# EasyEDA Pro project Example_3D Shell Design.eprj, board 3D Shell Example-B
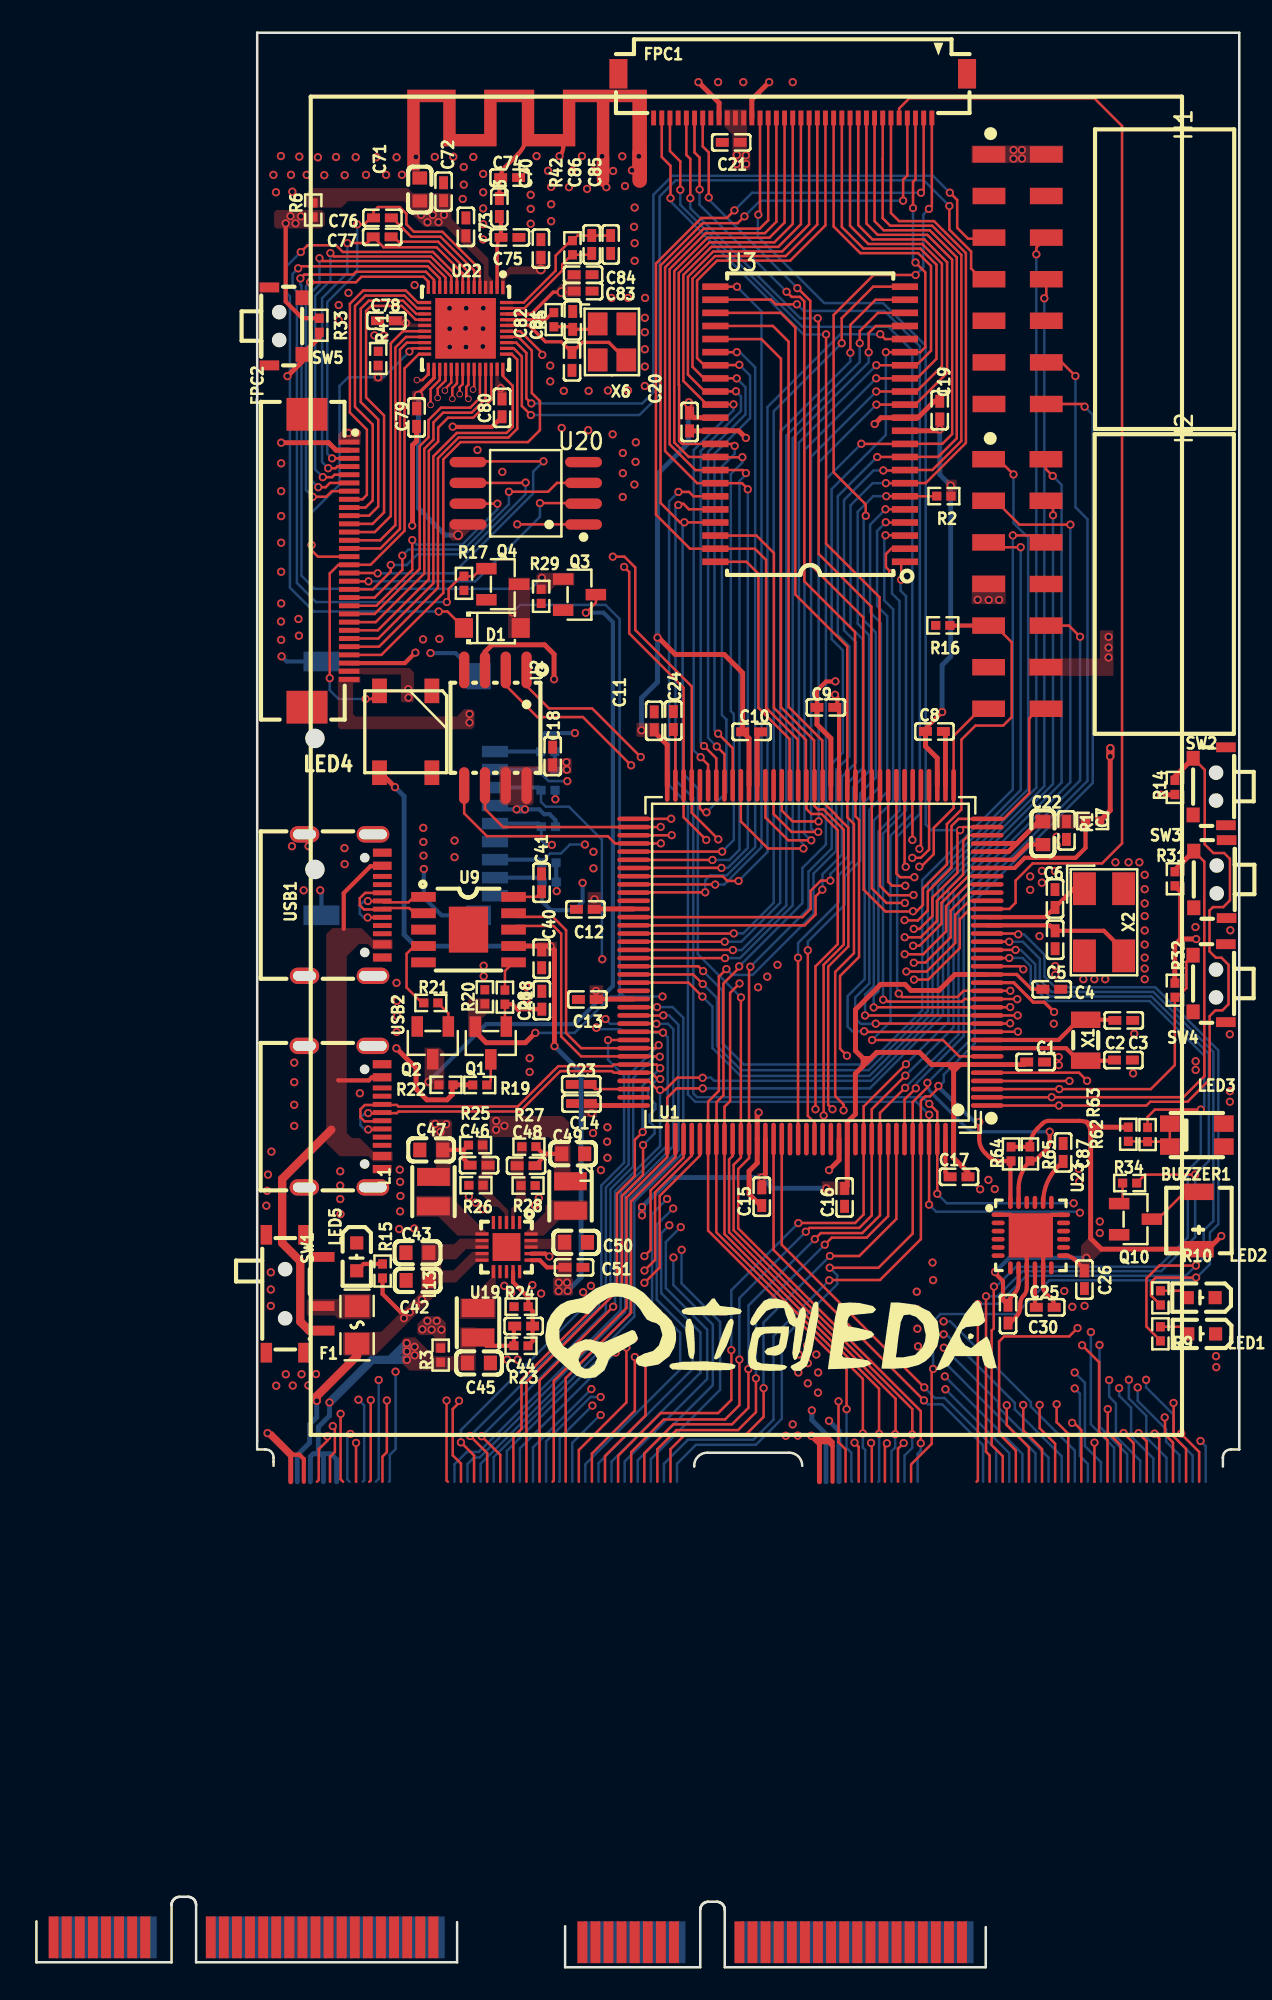
[diagram p0: board, top side]
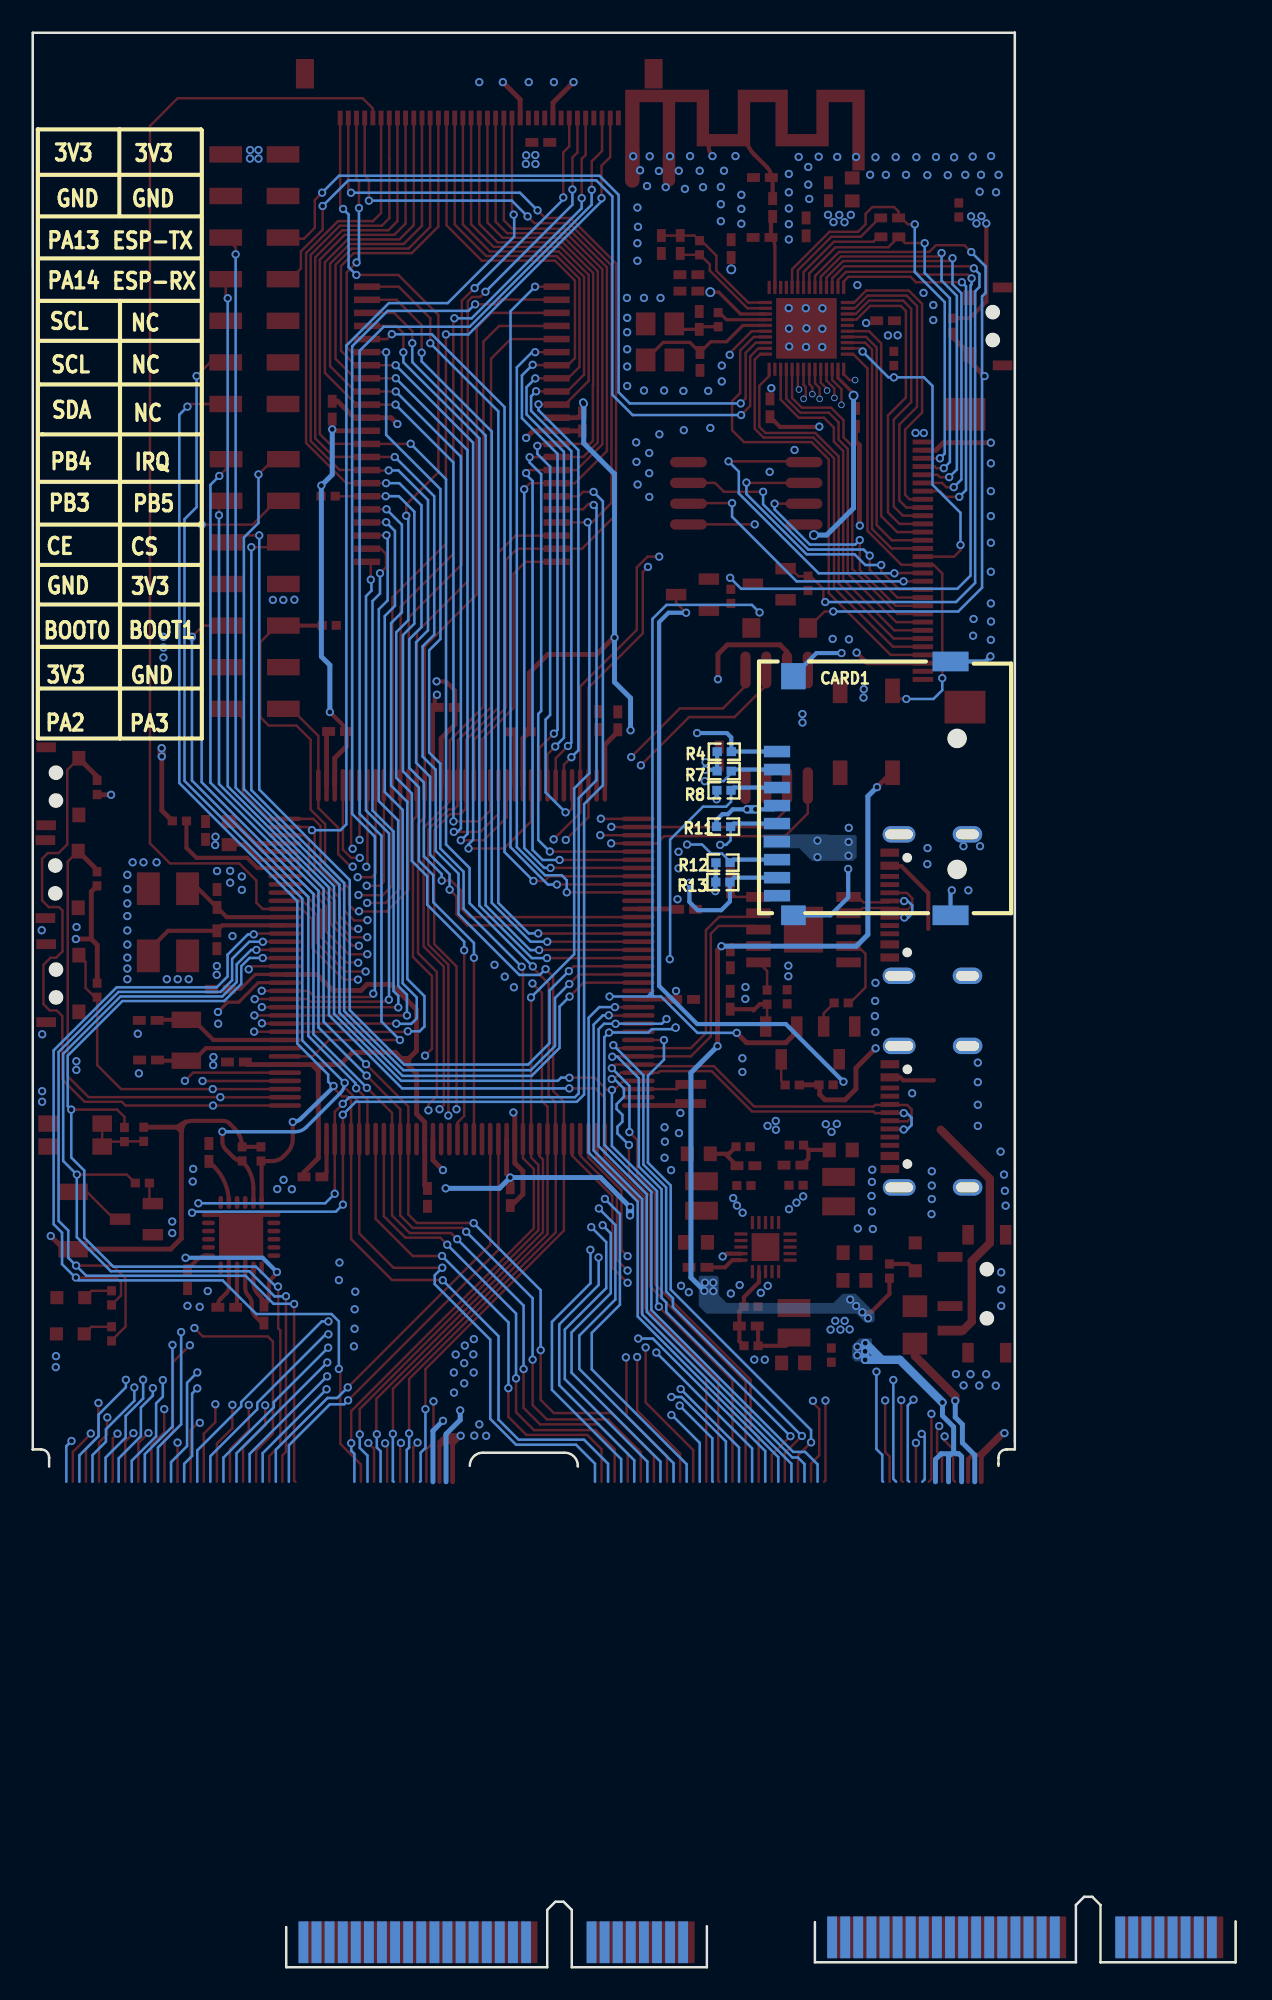
[diagram p1: board, bottom side, seen from below]

Outline 73.49 x 118.12 mm; copper layers: Top Layer, Inner1, Inner2, Bottom Layer. Coordinates in mm from the lower left corner of the outline.
Outline path: 14.49,30.62 14.49,31.12 arc(14.34,31.48) 13.99,31.62 13.99,31.62 13.49,31.62 13.49,118.12 73.49,118.12 73.48,31.62 73.48,31.62 72.99,31.62 arc(72.63,31.48) 72.49,31.12 72.49,30.57 ; 40.19,30.57 40.19,30.62 arc(40.42,31.19) 40.99,31.42 45.98,31.42 arc(46.55,31.19) 46.79,30.62
Stack: Top Layer 0.035mm / 介电1 0.48mm PP er 4.5 / Inner1 0.035mm / 介电2 0.48mm FR4 er 4.5 / Inner2 0.035mm / 介电3 0.48mm PP er 4.5 / Bottom Layer 0.035mm

## Design rules (mm)
spacing Common: track to track 0.152, other pairs 0.152 to 0.3
spacing 安全间距 (default): track to track 0.127, other pairs 0.127 to 0.3
track width Common: min 0.127, default 0.254, max 2.54
track width 导线 (default): min 0.127, default 0.254, max 5
differential pair Common (default): width min 0.127, default 0.254, max 2.54; gap min 0.152, default 0.152
via Common: diameter min 0.5, default 0.61, max 10; hole min 0.3, default 0.305, max 6
via 过孔尺寸 (default): diameter min 0.4, default 0.5, max 10; hole min 0.3, default 0.3, max 6

## Placement (name value [footprint] x y rotation side)
BUZZER1  4000Hz  [buz-smd_l4.0-w4.0-p3.50-l]  71.02 45.59 90 top
C1  100nF  [c0402]  61.04 55.27 180 top
C2  10pF  [c0402]  66.43 57.81 0 top
C3  10pF  [c0402]  66.41 55.39 0 top
C4  100nF  [c0402]  62.03 59.71 180 top
C5  22pF  [c0402]  62.24 62.74 90 top
C6  22pF  [c0402]  62.23 65.26 270 top
C7  100nF  [c0402]  62.93 69.41 270 top
C8  100nF  [c0402]  54.86 75.45 180 top
C9  100nF  [c0402]  48.23 76.92 180 top
C10  100nF  [c0402]  43.69 75.43 180 top
C11  100nF  [c0402]  37.74 76.11 270 top
C12  100nF  [c0402]  33.54 64.6 180 top
C13  100nF  [c0402]  33.66 59.09 180 top
C14  100nF  [c0402]  33.3 52.74 180 top
C15  100nF  [c0402]  44.31 47.05 270 top
C16  100nF  [c0402]  49.37 47.01 270 top
C17  100nF  [c0402]  56.37 48.26 180 top
C18  100nF  [c0402]  31.54 73.95 90 top
C19  100nF  [c0402]  55.19 95.07 270 top
C20  100nF  [c0402]  39.91 94.35 270 top
C21  100nF  [c0402]  42.45 111.42 0 top
C22  10uF  [c0603]  61.49 69.25 90 top
C23  2.2uF  [c0402]  33.28 53.91 180 top
C24  2.2uF  [c0402]  38.91 76.12 270 top
C25  100nF  [c0402]  61.63 40.3 0 top
C26  100nF  [c0402]  64.03 41.98 90 top
C28  100nf  [c0402]  30.88 59.04 270 top
C30  10nF  [c0402]  59.36 39.88 270 top
C40  1uF  [c0402]  30.87 61.58 90 top
C41  100nF  [c0402]  30.86 66.22 270 top
C42  10uF  [c0603]  23.29 41.94 180 top
C43  10uF  [c0603]  23.28 43.63 180 top
C44  220pF  [c0402]  29.77 39.15 0 top
C45  10uF  [c0603]  27.03 36.9 180 top
C46  220pF  [c0402]  27.04 48.97 0 top
C47  10uF  [c0603]  24.12 49.9 0 top
C48  220pF  [c0402]  29.91 48.94 0 top
C49  10uF  [c0603]  32.79 49.67 0 top
C50  10uF  [c0603]  32.97 44.26 180 top
C51  1uF  [c0402]  32.84 42.74 180 top
C70  100nF  [c0402]  30.82 104.94 270 top
C71  10uF  [c0603]  23.42 108.55 90 top
C72  1uF  [c0402]  24.87 108.41 270 top
C73  100nF  [c0402]  26.24 106.27 270 top
C74  TBD  [c0402]  28.91 109.27 0 top
C75  TBD  [c0402]  28.93 105.62 0 top
C76  270pF(NC)  [c0402]  21.14 106.81 180 top
C77  270pF(NC)  [c0402]  21.12 105.65 0 top
C78  100nF  [c0402]  21.38 100.53 0 top
C79  4.7uF  [c0402]  23.23 94.63 90 top
C80  100nF  [c0402]  28.45 95.22 90 top
C81  22pF  [c0402]  32.72 98.05 90 top
C82  22pF  [c0402]  32.77 100.55 270 top
C83  1uF  [c0402]  33.4 102.34 180 top
C84  100pF  [c0402]  33.4 103.34 180 top
C85  3.3nF  [c0402]  33.93 105.19 90 top
C86  10nF  [c0402]  35.08 105.19 270 top
C87  2.2nF  [c0402]  62.72 49.75 90 top
CARD1  -  [tf-smd_xktf-n02-n]  22.71 71.98 90 bottom
D1  -  [sod-123_l2.7-w1.6-ls3.8-rd]  27.85 81.77 0 top
F1  -  [f0805]  19.59 39.22 270 top
FPC1  -  [fpc-smd_f0502-b-35-15t-r]  46.21 114.26 180 top
FPC2  -  [fpc-smd_30p-p0.50_xunpu_fpc-05f-30ph20]  17.82 85.88 270 top
H1  -  [hdr-smd_14p-p2.54-h-f-r2-c7-s3.50]  59.94 103.07 270 top
H2  -  [hdr-smd_14p-p2.54-h-f-r2-c7-s3.50]  59.92 84.46 270 top
L1  1.5uH  [ind-smd_l2.5-w2.0_252012]  24.26 47.36 270 top
L2  1.5uH  [ind-smd_l2.5-w2.0_252012]  32.63 47.09 270 top
L3  TBD  [l0402]  28.28 107.45 270 top
L13  1.5uH  [ind-smd_l2.5-w2.0_252012]  26.98 39.35 270 top
LED1  -  [led0603-r-rd]  71.19 38.67 180 top
LED2  -  [led0603-r-rd]  71.16 40.88 180 top
LED3  -  [led-smd_4p-l3.2-w2.7-r-rd]  70.89 50.81 0 top
LED4  WS2812B  [ws2812b]  22.56 75.43 90 top
LED5  -  [led0603-r-rd]  19.57 43.38 270 top
Q1  -  [sot-23-3_l2.9-w1.3-p1.90-ls2.4-br]  27.76 56.43 90 top
Q2  -  [sot-23-3_l2.9-w1.3-p1.90-ls2.4-br]  24.22 56.44 90 top
Q3  -  [sot-23-3_l2.9-w1.3-p1.90-ls2.4-br]  33.18 83.81 180 top
Q4  -  [sot-23-3_l2.9-w1.3-p1.90-ls2.4-br]  28.49 84.45 180 top
Q10  -  [sot-23-3_l2.9-w1.3-p1.90-ls2.4-br]  67.15 45.68 180 top
R1  10Ω  [r0402]  64.53 69.99 180 top
R2  10kΩ  [r0402]  55.44 89.82 180 top
R3  0Ω  [r0402]  24.7 37.37 90 top
R4  10kΩ  [r0402]  31.24 74.22 180 bottom
R5  0Ω  [r0402]  31.61 100.6 270 top
R6  0Ω  [r0402]  16.91 107.3 90 top
R7  10kΩ  [r0402]  31.24 73.04 180 bottom
R8  10kΩ  [r0402]  31.26 71.86 180 bottom
R9  4.7kΩ  [r0402]  68.67 38.67 90 top
R10  4.7kΩ  [r0402]  68.67 40.87 90 top
R11  10kΩ  [r0402]  31.28 69.64 180 bottom
R12  10kΩ  [r0402]  31.31 67.44 180 bottom
R13  10kΩ  [r0402]  31.32 66.26 180 bottom
R14  10kΩ  [r0402]  69.55 72.04 270 top
R15  4.7kΩ  [r0402]  21.15 42.51 90 top
R16  10kΩ  [r0402]  55.37 81.93 0 top
R17  10kΩ  [r0402]  26.12 84.5 90 top
R18  10kΩ  [r0402]  28.62 59.23 270 top
R19  1kΩ  [r0402]  27.09 53.87 180 top
R20  10kΩ  [r0402]  27.4 59.25 270 top
R21  10kΩ  [r0402]  24.1 58.88 180 top
R22  10kΩ  [r0402]  25.02 53.88 0 top
R23  68kΩ  [r0402]  29.6 37.94 0 top
R24  15kΩ  [r0402]  29.61 40.34 180 top
R25  110K  [r0402]  26.83 50.2 0 top
R26  30kΩ  [r0402]  26.85 47.75 0 top
R27  100kΩ  [r0402]  30.09 50.1 0 top
R28  100kΩ  [r0402]  30.04 47.73 0 top
R29  10kΩ  [r0402]  30.84 83.7 90 top
R31  10kΩ  [r0402]  69.56 66.46 270 top
R32  10kΩ  [r0402]  69.55 59.66 90 top
R33  10kΩ  [r0402]  17.28 100.26 90 top
R34  1kΩ  [r0402]  66.79 47.88 180 top
R41  0Ω(NC)  [r0402]  20.88 98.23 270 top
R42  20kΩ  [r0402]  32.75 104.99 90 top
R62  47kΩ  [r0402]  66.71 50.86 90 top
R63  1kΩ  [r0402]  67.88 50.84 270 top
R64  4.7kΩ  [r0402]  59.54 49.66 90 top
R65  4.7kΩ  [r0402]  60.7 49.66 90 top
SW1  -  [sw-th_msk12c02]  15.75 41.12 270 top
SW2  -  [key-smd_k2-1806sa-axxw-xx]  71.67 72.11 270 top
SW3  -  [key-smd_k2-1806sa-axxw-xx]  71.71 66.44 270 top
SW4  -  [key-smd_k2-1806sa-axxw-xx]  71.67 60.09 270 top
SW5  -  [key-smd_k2-1806sa-axxw-xx]  15.23 100.19 90 top
U1  -  [lqfp-144_l20.0-w20.0-p0.50-ls22.0-bl]  47.29 61.37 90 top
U2  -  [soic-8_l5.2-w5.2-p1.27-ls7.9-bl]  28.04 75.68 180 top
U3  IS62WV51216  [tsopii-44_l18.4-w10.2-p0.80-ls11.8-bl]  47.27 94.21 90 top
U4  -  [mini-pcie 0.8-52p]  46.79 28.22 0 top
U5  -  [mini-pcie 0.8-52p]  14.49 28.52 0 top
U9  -  [esop-10_l4.9-w3.9-p1.00-ls6.2-bl-ep]  26.4 63.36 270 top
U19  -  [wqfn-20_l3.0-w3.0-p0.40-bl-ep]  28.72 43.97 180 top
U20  -  [soic-8_l5.3-w5.3-p1.27-ls8.0-bl]  29.9 90 90 top
U22  -  [qfn-48_l5.0-w5.0-p0.35-bl-ep3.7]  26.22 100.07 180 top
U23  -  [qfn-24_l4.0-w4.0-p0.50-bl-ep2.7]  60.75 44.7 270 top
U24  -  [tan]  29.99 111.72 0 top
USB1  -  [usb-c-smd_type-c-31-m-31]  18.76 64.85 270 top
USB2  -  [usb-c-smd_type-c-31-m-31]  18.75 51.94 270 top
X1  32.768kHz  [fc-135r_l3.2-w1.5]  64.1 56.6 90 top
X2  8MHz  [osc-smd_4p-l5.0-w3.2-bl]  65.22 63.8 270 top
X6  40MHZ±10ppm  [osc-smd_4p-l3.2-w2.5-bl]  35.16 99.24 270 top

## Footprints (pads in the part's own frame, mm; a bottom-side part is the same pattern mirrored in y, then rotated)
buz-smd_l4.0-w4.0-p3.50-l
  rect 1.001x1.801 smd: 1(-1.75,0) 2(1.75,0)
c0402
  rect 0.79x0.541 smd: 1(-0.546,0) 2(0.546,0)
c0603
  rect 0.8x0.899 smd: 1(-0.701,0) 2(0.701,0)
esop-10_l4.9-w3.9-p1.00-ls6.2-bl-ep
  rect 0.6x1.501 smd: 1(-1.999,-2.751) 2(-1.001,-2.751) 3(0,-2.751) 4(1.001,-2.751) 5(1.999,-2.751) 6(1.999,2.751) 7(1.001,2.751) 8(0,2.751) 9(-1.001,2.751) 10(-1.999,2.751)
  rect 2.799x2.401 smd: 11(0,0)
f0805
  rect 1.336x1.501 smd: 1(-1.143,0) 2(1.143,0)
fc-135r_l3.2-w1.5
  rect 1.001x1.801 smd: 1(-1.25,0) 2(1.25,0)
fpc-smd_30p-p0.50_xunpu_fpc-05f-30ph20
  rect 0.299x1.25 smd: 1(-7.249,1.288) 2(-6.749,1.288) 3(-6.251,1.288) 4(-5.75,1.288) 5(-5.25,1.288) 6(-4.75,1.288) 7(-4.25,1.288) 8(-3.749,1.288) 9(-3.248,1.288) 10(-2.751,1.288) 11(-2.251,1.288) 12(-1.75,1.288) 13(-1.25,1.288) 14(-0.75,1.288) 15(-0.249,1.288) 16(0.249,1.288) 17(0.75,1.288) 18(1.25,1.288) 19(1.75,1.288) 20(2.251,1.288) 21(2.751,1.288) 22(3.251,1.288) 23(3.749,1.288) 24(4.25,1.288) 25(4.75,1.288) 26(5.25,1.288) 27(5.75,1.288) 28(6.251,1.288) 29(6.752,1.288) 30(7.249,1.288)
  rect 1.999x2.499 smd: 31(8.941,-1.288) 32(-8.941,-1.288)
fpc-smd_f0502-b-35-15t-r
  rect 0.299x0.899 smd: 1(-8.499,1.351) 2(-8.001,1.351) 3(-7.5,1.351) 4(-7,1.351) 5(-6.5,1.351) 6(-6,1.351) 7(-5.499,1.351) 8(-4.998,1.351) 9(-4.501,1.351) 10(-4,1.351) 11(-3.5,1.351) 12(-2.999,1.351) 13(-2.499,1.351) 14(-1.999,1.351) 15(-1.501,1.351) 16(-1.001,1.351) 17(-0.5,1.351) 18(0,1.351) 19(0.5,1.351) 20(1.001,1.351) 21(1.501,1.351) 22(1.999,1.351) 23(2.499,1.351) 24(2.999,1.351) 25(3.5,1.351) 26(4,1.351) 27(4.501,1.351) 28(5.002,1.351) 29(5.499,1.351) 30(6,1.351) 31(6.5,1.351) 32(7,1.351) 33(7.5,1.351) 34(8.001,1.351) 35(8.499,1.351)
  rect 1.1x1.801 smd: 36(10.65,-1.349) 37(-10.65,-1.349)
hdr-smd_14p-p2.54-h-f-r2-c7-s3.50
  rect 1.001x1.999 smd: 1(-7.62,-1.75) 2(-7.62,1.75) 3(-5.08,-1.75) 4(-5.08,1.75) 5(-2.54,-1.75) 6(-2.54,1.75) 7(0,-1.75) 8(0,1.75) 9(2.54,-1.75) 10(2.54,1.75) 11(5.08,-1.75) 12(5.08,1.75) 13(7.62,-1.75) 14(7.62,1.75)
ind-smd_l2.5-w2.0_252012
  rect 1.1x1.999 smd: 1(-0.899,0) 2(0.899,0)
key-smd_k2-1806sa-axxw-xx
  rect 0.899x0.8 smd: 1(-1.71,-1.001) 2(1.75,-1.001)
  rect 0.6x1.199 smd: 3(-2.38,1.001) 4(2.38,1.001)
l0402
  rect 0.79x0.541 smd: 1(-0.546,0) 2(0.546,0)
led0603-r-rd
  rect 0.8x0.8 smd: 1(0.851,0) 2(-0.851,0)
led-smd_4p-l3.2-w2.7-r-rd
  rect 1.199x1.001 smd: 1(1.651,0.701) 1(1.651,-0.701) 2(-1.651,0.701) 2(-1.651,-0.701)
lqfp-144_l20.0-w20.0-p0.50-ls22.0-bl
  oval 0.28x1.999 smd: 1(-8.751,-10.8) 2(-8.25,-10.8) 3(-7.75,-10.8) 4(-7.249,-10.8) 5(-6.749,-10.8) 6(-6.251,-10.8) 7(-5.75,-10.8) 8(-5.25,-10.8) 9(-4.75,-10.8) 10(-4.25,-10.8) 11(-3.749,-10.8) 12(-3.251,-10.8) 13(-2.751,-10.8) 14(-2.251,-10.8) 15(-1.75,-10.8) 16(-1.25,-10.8) 17(-0.75,-10.8) 18(-0.249,-10.8) 19(0.249,-10.8) 20(0.75,-10.8) 21(1.25,-10.8) 22(1.75,-10.8) 23(2.251,-10.8) 24(2.751,-10.8) 25(3.251,-10.8) 26(3.749,-10.8) 27(4.25,-10.8) 28(4.75,-10.8) 29(5.25,-10.8) 30(5.75,-10.8) 31(6.251,-10.8) 32(6.752,-10.8) 33(7.249,-10.8) 34(7.75,-10.8) 35(8.25,-10.8) 36(8.751,-10.8) 73(8.751,10.8) 74(8.25,10.8) 75(7.75,10.8) 76(7.249,10.8) 77(6.752,10.8) 78(6.251,10.8) 79(5.75,10.8) 80(5.25,10.8) 81(4.75,10.8) 82(4.25,10.8) 83(3.749,10.8) 84(3.251,10.8) 85(2.751,10.8) 86(2.251,10.8) 87(1.75,10.8) 88(1.25,10.8) 89(0.75,10.8) 90(0.249,10.8) 91(-0.249,10.8) 92(-0.75,10.8) 93(-1.25,10.8) 94(-1.75,10.8) 95(-2.251,10.8) 96(-2.751,10.8) 97(-3.251,10.8) 98(-3.749,10.8) 99(-4.25,10.8) 100(-4.75,10.8) 101(-5.25,10.8) 102(-5.75,10.8) 103(-6.251,10.8) 104(-6.749,10.8) 105(-7.249,10.8) 106(-7.75,10.8) 107(-8.25,10.8) 108(-8.751,10.8)
  oval 1.999x0.28 smd: 37(10.8,-8.751) 38(10.8,-8.25) 39(10.8,-7.75) 40(10.8,-7.249) 41(10.8,-6.749) 42(10.8,-6.251) 43(10.8,-5.75) 44(10.8,-5.25) 45(10.8,-4.75) 46(10.8,-4.25) 47(10.8,-3.749) 48(10.8,-3.251) 49(10.8,-2.751) 50(10.8,-2.251) 51(10.8,-1.75) 52(10.8,-1.25) 53(10.8,-0.75) 54(10.8,-0.249) 55(10.8,0.249) 56(10.8,0.75) 57(10.8,1.25) 58(10.8,1.75) 59(10.8,2.251) 60(10.8,2.751) 61(10.8,3.251) 62(10.8,3.749) 63(10.8,4.25) 64(10.8,4.75) 65(10.8,5.25) 66(10.8,5.75) 67(10.8,6.251) 68(10.8,6.749) 69(10.8,7.249) 70(10.8,7.75) 71(10.8,8.25) 72(10.8,8.751) 109(-10.8,8.751) 110(-10.8,8.25) 111(-10.8,7.75) 112(-10.8,7.249) 113(-10.8,6.749) 114(-10.8,6.251) 115(-10.8,5.75) 116(-10.8,5.25) 117(-10.8,4.75) 118(-10.8,4.25) 119(-10.8,3.749) 120(-10.8,3.251) 121(-10.8,2.751) 122(-10.8,2.251) 123(-10.8,1.75) 124(-10.8,1.25) 125(-10.8,0.75) 126(-10.8,0.249) 127(-10.8,-0.249) 128(-10.8,-0.75) 129(-10.8,-1.25) 130(-10.8,-1.75) 131(-10.8,-2.251) 132(-10.8,-2.751) 133(-10.8,-3.251) 134(-10.8,-3.749) 135(-10.8,-4.25) 136(-10.8,-4.75) 137(-10.8,-5.25) 138(-10.8,-5.75) 139(-10.8,-6.251) 140(-10.8,-6.749) 141(-10.8,-7.249) 142(-10.8,-7.75) 143(-10.8,-8.25) 144(-10.8,-8.751)
mini-pcie 0.8-52p
  rect 0.6x2.55 smd: 1(-13.437,-26.692) 3(-12.637,-26.692) 5(-11.837,-26.692) 7(-11.037,-26.692) 9(-10.237,-26.692) 11(-9.437,-26.692) 13(-8.637,-26.692) 15(-7.837,-26.692) 17(-3.837,-26.692) 19(-3.037,-26.692) 21(-2.237,-26.692) 23(-1.437,-26.692) 25(-0.637,-26.692) 27(0.163,-26.692) 29(0.963,-26.692) 31(1.763,-26.692) 33(2.563,-26.692) 35(3.363,-26.692) 37(4.163,-26.692) 39(4.963,-26.692) 41(5.763,-26.692) 43(6.563,-26.692) 45(7.363,-26.692) 47(8.163,-26.692) 49(8.963,-26.692) 51(9.763,-26.692)
  rect 0.6x2.55 smd far side: 2(-13.037,-26.692) 4(-12.237,-26.692) 6(-11.437,-26.692) 8(-10.637,-26.692) 10(-9.837,-26.692) 12(-9.037,-26.692) 14(-8.237,-26.692) 16(-7.437,-26.692) 18(-3.437,-26.692) 20(-2.637,-26.692) 22(-1.837,-26.692) 24(-1.037,-26.692) 26(-0.237,-26.692) 28(0.563,-26.692) 30(1.363,-26.692) 32(2.163,-26.692) 34(2.963,-26.692) 36(3.763,-26.692) 38(4.563,-26.692) 40(5.363,-26.692) 42(6.163,-26.692) 44(6.963,-26.692) 46(7.763,-26.692) 48(8.563,-26.692) 50(9.363,-26.692) 52(10.163,-26.692)
osc-smd_4p-l3.2-w2.5-bl
  rect 1.399x1.199 smd: 1(-1.1,-0.874) 2(1.1,-0.874) 3(1.1,0.876) 4(-1.1,0.876)
osc-smd_4p-l5.0-w3.2-bl
  rect 1.999x1.399 smd: 1(-2.05,-1.199) 2(2.05,-1.199) 3(2.05,1.199) 4(-2.05,1.199)
qfn-24_l4.0-w4.0-p0.50-bl-ep2.7
  oval 0.28x0.8 smd: 1(-1.25,-1.999) 2(-0.75,-1.999) 3(-0.249,-1.999) 4(0.249,-1.999) 5(0.75,-1.999) 6(1.25,-1.999) 13(1.25,1.999) 14(0.75,1.999) 15(0.249,1.999) 16(-0.249,1.999) 17(-0.75,1.999) 18(-1.242,1.999)
  oval 0.8x0.28 smd: 7(1.999,-1.25) 8(1.999,-0.75) 9(1.999,-0.249) 10(1.999,0.249) 11(1.999,0.75) 12(1.999,1.25) 19(-1.999,1.25) 20(-1.999,0.75) 21(-1.999,0.249) 22(-1.999,-0.249) 23(-1.999,-0.75) 24(-1.999,-1.25)
  rect 2.7x2.7 smd: 25(0.013,0)
qfn-48_l5.0-w5.0-p0.35-bl-ep3.7
  rect 0.201x0.8 smd: 1(-2.276,-2.499) 2(-1.925,-2.499) 3(-1.575,-2.499) 4(-1.224,-2.499) 5(-0.876,-2.499) 6(-0.526,-2.499) 7(-0.175,-2.499) 8(0.175,-2.499) 9(0.526,-2.499) 10(0.874,-2.499) 11(1.224,-2.499) 12(1.575,-2.499) 13(1.925,-2.499) 14(2.276,-2.499) 25(2.276,2.499) 26(1.925,2.499) 27(1.575,2.499) 28(1.224,2.499) 29(0.874,2.499) 30(0.526,2.499) 31(0.175,2.499) 32(-0.175,2.499) 33(-0.526,2.499) 34(-0.876,2.499) 35(-1.224,2.499) 36(-1.575,2.499) 37(-1.925,2.499) 38(-2.276,2.499)
  rect 0.8x0.201 smd: 15(2.499,-1.575) 16(2.499,-1.224) 17(2.499,-0.876) 18(2.499,-0.526) 19(2.499,-0.175) 20(2.499,0.175) 21(2.499,0.526) 22(2.499,0.874) 23(2.499,1.224) 24(2.499,1.575) 39(-2.499,1.575) 40(-2.499,1.224) 41(-2.499,0.874) 42(-2.499,0.526) 43(-2.499,0.175) 44(-2.499,-0.175) 45(-2.499,-0.526) 46(-2.499,-0.876) 47(-2.499,-1.224) 48(-2.499,-1.575)
  rect 3.701x3.701 smd: 49(0,0)
r0402
  rect 0.567x0.541 smd: 1(-0.432,0) 2(0.432,0)
sod-123_l2.7-w1.6-ls3.8-rd
  rect 1.1x1.199 smd: 1(-1.735,0) 2(1.735,0)
soic-8_l5.2-w5.2-p1.27-ls7.9-bl
  oval 0.63x2.251 smd: 1(-1.905,-3.53) 2(-0.635,-3.53) 3(0.635,-3.53) 4(1.905,-3.53) 5(1.905,3.53) 6(0.635,3.53) 7(-0.635,3.53) 8(-1.905,3.53)
soic-8_l5.3-w5.3-p1.27-ls8.0-bl
  oval 0.63x2.251 smd: 1(-1.905,-3.53) 2(-0.635,-3.53) 3(0.635,-3.53) 4(1.905,-3.53) 5(1.905,3.53) 6(0.635,3.53) 7(-0.635,3.53) 8(-1.905,3.53)
sot-23-3_l2.9-w1.3-p1.90-ls2.4-br
  rect 1.25x0.701 smd: 1(1.001,-0.95) 2(1.001,0.95) 3(-1.001,0)
sw-th_msk12c02
  rect 0.6x1.524 smd: 1(-2.251,1.7) 2(0.75,1.7) 3(2.251,1.7)
  rect 1.199x0.701 smd: 4(-3.599,0.6) 4(-3.599,-1.7) 4(3.599,0.6) 4(3.599,-1.7)
tan
  round 0.399 smd: 1(4.63,-2.621) 2(6.868,-2.621)
tf-smd_xktf-n02-n
  rect 0.701x1.6 smd: 1(2.251,5.301) 2(1.151,5.301) 3(0.051,5.301) 4(-1.049,5.301) 5(-2.149,5.301) 6(-3.251,5.301) 7(-4.351,5.301) 8(-5.451,5.301) 9(-6.551,5.301)
  rect 1.199x1.501 smd: 10(-7.75,4.3)
  rect 1.199x2.2 smd: 11(-7.75,-5.301) 13(7.75,-5.301)
  rect 1.6x1.501 smd: 12(6.851,4.3)
tsopii-44_l18.4-w10.2-p0.80-ls11.8-bl
  rect 0.399x1.6 smd: 1(-8.4,-5.791) 2(-7.599,-5.791) 3(-6.8,-5.791) 4(-6,-5.791) 5(-5.199,-5.791) 6(-4.399,-5.791) 7(-3.599,-5.791) 8(-2.799,-5.791) 9(-1.999,-5.791) 10(-1.202,-5.791) 11(-0.399,-5.791) 12(0.402,-5.791) 13(1.199,-5.791) 14(1.999,-5.791) 15(2.801,-5.791) 16(3.602,-5.791) 17(4.402,-5.791) 18(5.202,-5.791) 19(6,-5.791) 20(6.8,-5.791) 21(7.599,-5.791) 22(8.4,-5.791) 23(8.4,5.791) 24(7.599,5.791) 25(6.8,5.791) 26(6,5.791) 27(5.202,5.791) 28(4.402,5.791) 29(3.602,5.791) 30(2.801,5.791) 31(1.999,5.791) 32(1.199,5.791) 33(0.402,5.791) 34(-0.399,5.791) 35(-1.202,5.791) 36(-1.999,5.791) 37(-2.799,5.791) 38(-3.599,5.791) 39(-4.399,5.791) 40(-5.199,5.791) 41(-6,5.791) 42(-6.8,5.791) 43(-7.599,5.791) 44(-8.4,5.791)
usb-c-smd_type-c-31-m-31
  oval 1.001x1.999 hole 0.6x1.7: 1(-4.321,1.806) 1(4.321,1.806)
  oval 1.001x1.801 hole 0.6x1.399: 1(-4.321,-2.375) 1(4.321,-2.375)
  rect 0.5x1.141 smd: A1(-3.2,2.373) A4(-2.401,2.373) A9(2.401,2.373) A12(3.2,2.373)
  rect 0.299x1.141 smd: A5(-1.25,2.373) A6(-0.249,2.373) A7(0.249,2.373) A8(1.25,2.375) B5(1.75,2.373) B6(0.75,2.373) B7(-0.75,2.373) B8(-1.75,2.375)
wqfn-20_l3.0-w3.0-p0.40-bl-ep
  rect 0.201x0.8 smd: 1(-0.8,-1.498) 2(-0.402,-1.498) 3(0,-1.498) 4(0.399,-1.498) 5(0.8,-1.498) 11(0.8,1.501) 12(0.399,1.501) 13(0,1.501) 14(-0.402,1.501) 15(-0.8,1.501)
  rect 0.8x0.201 smd: 6(1.501,-0.8) 7(1.501,-0.399) 8(1.501,0) 9(1.501,0.399) 10(1.501,0.8) 16(-1.501,0.8) 17(-1.501,0.402) 18(-1.501,0) 19(-1.501,-0.399) 20(-1.501,-0.8)
  rect 1.7x1.7 smd: 21(0,0)
ws2812b
  rect 1.501x0.899 smd: 1(-2.499,1.6) 2(-2.499,-1.6) 3(2.499,-1.6) 4(2.499,1.6)

## Nets
1.2V: C48.2 C49.1 FPC2.30 L2.1 R27.2
2.8V: C46.1 C47.2 FPC2.29 L1.1 R25.1
3V3: BUZZER1.1 C21.2 C26.2 C30.1 C44.1 C45.2 FPC1.24 FPC1.25 FPC1.26 H1.1 H1.2 H2.7 H2.12 L13.2 R1.1 R3.1 R6.1 R14.2 R19.2 R22.2 R23.1 R31.2 R32.2 R33.2 R62.2 R64.2 R65.2 U4.4 U5.4 U5.6 U5.8 U23.8 U23.13
5V: SW1.3 USB1.A4 USB1.A9 USB2.A4 USB2.A9
5V-OUT: C40.2 C42.1 C43.1 C50.2 C51.2 F1.2 LED4.1 R15.1 U4.2 U5.2 U9.7 U19.7 U19.8 U19.9 U19.10 U19.16 U19.18 U19.19
GND: C1.1 C2.2 C3.2 C4.1 C5.1 C6.1 C7.2 C8.1 C9.1 C10.1 C11.1 C12.2 C13.2 C14.2 C15.2 C16.2 C17.2 C18.2 C19.1 C20.2 C21.1 C22.1 C23.2 C24.1 C25.2 C26.1 C28.1 C30.2 C40.1 C41.1 C42.2 C43.2 C45.1 C47.1 C49.2 C50.1 C51.1 C70.1 C71.2 C72.1 C73.1 C74.2 C75.2 C78.1 C79.1 C80.1 C81.1 C82.1 C83.1 C84.1 C86.2 C87.2 CARD1.6 CARD1.10 CARD1.11 CARD1.12 CARD1.13 FPC1.23 FPC1.27 FPC1.28 FPC1.35 FPC1.36 FPC1.37 FPC2.2 FPC2.28 FPC2.31 FPC2.32 H1.3 H1.4 H2.8 H2.11 LED1.2 LED2.2 LED3.1 LED4.3 LED5.2 Q2.2 Q3.2 Q4.2 Q10.2 R16.1 R17.1 R20.1 R24.2 R26.1 R28.2 R29.1 R41.1 SW1.4 SW2.2 SW2.4 SW3.2 SW3.4 SW4.2 SW4.4 SW5.2 SW5.4 U1.16 U1.31 U1.38 U1.51 U1.61 U1.83 U1.94 U1.107 U1.120 U1.130 U1.143 U2.4 U3.12 U3.34 U4.1 U4.3 U5.1 U5.3 U9.3 U9.11 U19.1 U19.4 U19.5 U19.12 U19.13 U19.15 U19.17 U20.4 U22.49 U23.1 U23.9 U23.11 U23.18 U23.25 U24.2 USB1.1 USB1.A1 USB1.A12 USB2.1 USB2.A1 USB2.A12
VCC3.3M: C1.2 C4.2 C8.2 C9.2 C10.2 C11.2 C12.1 C13.1 C14.1 C15.1 C16.1 C17.1 C18.1 C19.2 C20.1 CARD1.4 R2.1 R3.2 R4.1 R7.1 R8.1 R11.1 R12.1 R13.1 U1.6 U1.17 U1.39 U1.52 U1.62 U1.72 U1.84 U1.95 U1.108 U1.121 U1.131 U1.144 U2.3 U2.7 U2.8 U3.11 U3.33
VDD-SDIO: C79.2 U20.8 U22.26
VDDA: C7.1 C22.2 R1.2 U1.30 U1.32 U1.33
ADC-LIGHT: R63.1 U1.19 U4.21
BEEP: R34.1 U1.20 U4.19
BOOT0: H2.10 Q2.3 Q3.3 R22.1 U1.138
BOOT1: FPC1.29 H2.9 R16.2 U1.48 U5.41
CLK: CARD1.5 R11.2 U1.111 U5.16
CMD: CARD1.3 R8.2 U1.116 U4.10
D0: CARD1.7 R12.2 U1.98 U5.20
D1: CARD1.8 R13.2 U1.99 U5.18
D2: CARD1.1 R4.2 U1.113 U5.12
D3: CARD1.2 R7.2 U1.112 U5.14
D+: U9.1 USB1.A6 USB1.B6
D-: U9.2 USB1.A7 USB1.B7
DTR: R21.2 U9.4
ESP3V3: C70.2 C71.1 C72.2 C73.2 C78.2 C80.2 C83.2 C84.2 FPC2.1 R6.2 U22.1 U22.3 U22.4 U22.19 U22.37 U22.43 U22.46
ESP-RST: D1.1 R33.1 SW5.1 U22.9
ESP-U0RXD: H1.7 U22.40
ESP-U0TXD: H1.5 U22.41
ESP-U1RXD: U1.69 U5.48 U22.25
ESP-U1TXD: U1.70 U5.46 U22.27
F-CS: U1.73 U2.1 U5.44
FSMC-A0: U1.10 U3.5 U4.35
FSMC-A1: U1.11 U3.4 U4.33
FSMC-A2: U1.12 U3.3 U4.31
FSMC-A3: U1.13 U3.2 U4.29
FSMC-A4: U1.14 U3.1 U4.27
FSMC-A5: U1.15 U3.24 U4.25
FSMC-A6: U1.50 U3.25 U4.11
FSMC-A7: U1.53 U3.26 U4.9
FSMC-A8: U1.54 U3.27 U4.7
FSMC-A9: U1.55 U3.42 U4.5
FSMC-A10: FPC1.2 U1.56 U3.43
FSMC-A11: U1.57 U3.44
FSMC-A12: U1.87 U3.22
FSMC-A13: U1.88 U3.21
FSMC-A14: U1.89 U3.20
FSMC-A15: U1.90 U3.19
FSMC-A16: U1.80 U3.18 U4.28
FSMC-A17: U1.81 U3.23 U4.30
FSMC-A18: U1.82 U3.28 U4.32
FSMC-D0: FPC1.6 U1.85 U3.7 U4.34
FSMC-D1: FPC1.7 U1.86 U3.8 U4.36
FSMC-D2: FPC1.8 U1.114 U3.9 U4.6
FSMC-D3: FPC1.9 U1.115 U3.10 U4.8
FSMC-D4: FPC1.10 U1.58 U3.13 U4.52
FSMC-D5: FPC1.11 U1.59 U3.14 U4.51
FSMC-D6: FPC1.12 U1.60 U3.15 U4.49
FSMC-D7: FPC1.13 U1.63 U3.16 U4.47
FSMC-D8: FPC1.14 U1.64 U3.29 U4.45
FSMC-D9: FPC1.15 U1.65 U3.30 U4.43
FSMC-D10: FPC1.16 U1.66 U3.31 U4.41
FSMC-D11: FPC1.17 U1.67 U3.32 U4.39
FSMC-D12: FPC1.18 U1.68 U3.35 U4.37
FSMC-D13: FPC1.19 U1.77 U3.36 U4.22
FSMC-D14: FPC1.20 U1.78 U3.37 U4.24
FSMC-D15: FPC1.21 U1.79 U3.38 U4.26
FSMC-NBL0: U1.141 U3.39 U4.38
FSMC-NBL1: U1.142 U3.40 U4.40
FSMC-NE3: R2.2 U1.125 U3.6
FSMC-NE4: FPC1.1 U1.127
FSMC-NOE: FPC1.4 U1.118 U3.41 U4.14
FSMC-NWE: FPC1.3 U1.119 U3.17 U4.16
GPIO0: FPC2.15 R41.2 U22.23
GPIO2: FPC2.14 U22.22
GPIO4: FPC2.16 LED4.4 U22.24
GPIO5: FPC2.22 U22.34
GPIO12: FPC2.11 U22.18
GPIO13: FPC2.12 U22.20
GPIO14: FPC2.10 U22.17
GPIO15: FPC2.13 U22.21
GPIO18: FPC2.23 U22.35
GPIO19: FPC2.25 U22.38
GPIO21: FPC2.27 U22.42
GPIO22: FPC2.26 U22.39
GPIO23: FPC2.24 U22.36
GPIO25: FPC2.7 U22.14
GPIO26: FPC2.8 U22.15
GPIO27: FPC2.9 U22.16
GPIO32: Q4.1 R17.2 U22.12
GPIO33: Q3.1 R29.2 U22.13
GPIO34: FPC2.5 U22.10
GPIO35: FPC2.6 U22.11
IIC-SCL: H1.12 R65.1 U1.139 U5.52 U23.23
IIC-SDA: H1.14 R64.1 U1.140 U5.50 U23.24
KEY-DOWN: R31.1 SW3.1 U1.2 U4.44
KEY-OK: R32.1 SW4.1 U1.3 U4.46
KEY-UP: R14.1 SW2.1 U1.1 U4.42
LCD-BL: FPC1.22 U1.35 U5.7
LED0: R9.1 U1.21 U4.17
LED1: R10.1 U1.22 U4.15
NRF-CE: H2.6 U1.91
NRF-CS: H2.5 U1.92
NRF-IRQ: H2.1 U1.93
PA0: U1.34 U5.5
PA2: H2.14 U1.36 U5.9
PA3: H2.13 U1.37 U5.11
PA4: U1.40 U5.13
PA5: U1.41 U5.15
PA6: U1.42 U5.17
PA7: U1.43 U5.19
PA8: U1.100 U5.21
PA9: U1.101 U5.23 U9.9
PA10: U1.102 U5.25 U9.8
PA11: U1.103 U5.27 USB2.A7 USB2.B7
PA12: U1.104 U5.29 USB2.A6 USB2.B6
PA13: H1.6 U1.105 U5.31
PA14: H1.8 U1.109 U5.33
PA15: U1.110 U5.35
PB0: FPC1.34 U1.46 U5.37
PB1: FPC1.31 U1.47 U5.39
PB3: H2.4 U1.133 U5.43
PB4: H2.2 U1.134 U5.45
PB5: H2.3 U1.135 U5.47
PB6: U1.136 U5.49
PB7: U1.137 U5.51
PB13: U1.74 U2.6 U5.42
PB14: U1.75 U2.2 U5.40
PB15: U1.76 U2.5 U5.38
PC0: U1.26 U5.36
PC1: U1.27 U5.34
PC2: U1.28 U5.32
PC3: U1.29 U5.30
PC4: U1.44 U5.28
PC5: U1.45 U5.26
PC6: U1.96 U5.24
PC7: U1.97 U5.22
PC13: FPC1.33 U1.7 U5.10
PD3: U1.117 U4.12
PD6: U1.122 U4.18
PD7: U1.123 U4.20
PE5: U1.4 U4.48
PE6: U1.5 U4.50
PF6: U1.18 U4.23
PF11: FPC1.30 U1.49 U4.13
RESET: D1.2 FPC1.5 Q1.2 Q4.3 R20.2 U1.25
RTS: R18.1 U9.6
SCK/CLK: FPC2.19 U20.6 U22.31
SCS/CMD: U20.1 U22.30
SDI/SD1: FPC2.17 U20.5 U22.33
SDO/SD0: FPC2.18 U20.2 U22.32
SENSOR-VN: C77.1 FPC2.4 U22.8
SENSOR-VP: C76.2 FPC2.3 U22.5
SHD/SD2: FPC2.21 U20.7 U22.28
SWP/SD3: FPC2.20 U20.3 U22.29
$3N8948: C3.1 U1.8 X1.1
$3N8949: C2.1 U1.9 X1.2
$3N8950: C5.2 U1.23 X2.3
$3N8951: C6.2 U1.24 X2.1
$3N66254: LED1.1 R9.2
$3N66255: LED2.1 R10.2
$3N141143: C24.2 U1.71
$3N143962: C23.1 U1.106
$4N12256: C28.2 Q1.1 R18.2
$4N15383: Q2.1 R21.1
$4N64293: F1.1 SW1.2
$4N66337: L13.1 U19.11
$4N66338: C44.2 R23.2 R24.1 U19.14
$4N66341: L1.2 U19.6
$4N66342: C46.2 R25.2 R26.2 U19.3
$4N66343: C48.1 R27.1 R28.1 U19.2
$4N66354: L2.2 U19.20
$4N74032: Q1.3 R19.1
$4N117713: C41.2 U9.10
$4N125922: LED5.1 R15.2
$5N1486: C77.2 U22.7
$5N1487: C76.1 U22.6
$5N1489: C75.1 L3.2 U22.2
$5N7160: LED3.2 R62.1 R63.2
$5N7171: BUZZER1.2 Q10.3
$5N7172: Q10.1 R34.2
$5N46326: C74.1 L3.1 U24.1
$5N67812: C81.2 U22.44 X6.3
$5N67848: C82.2 R5.2 X6.1
$5N67920: C85.1 R42.1 U22.47
$5N67956: C85.2 C86.1 R42.2 U22.48
$5N89431: R5.1 U22.45
$5N112002: C25.1 U23.10
$5N113532: C87.1 U23.20

Pads without a net: CARD1 9; FPC1 32; H1 9 10 11 13; LED4 2; SW1 1; SW2 3; SW3 3; SW4 3; SW5 3; U1 124 126 128 129 132; U9 5; U19 21; U23 2 3 4 5 6 7 12 14 15 16 17 19 21 22; USB1 A5 A8 B5 B8; USB2 A5 A8 B5 B8; X2 2 4; X6 2 4

## Via types
v1: diameter 0.5, hole 0.3, Top Layer to Bottom Layer, 693 vias
v2: diameter 0.6, hole 0.4, Top Layer to Bottom Layer, 4 vias
v3: diameter 0.4, hole 0.3, Top Layer to Bottom Layer, 8 vias

## Routing (per net, layer and track width the routed paths; a pad name or vN(x,y) marks a point on that pad's centre or on a via; arc(x,y) is an arc through that point)
1.2V: length 2.8
  Top Layer w0.254: R27.2 30.96,49.67 31.19,49.67 ; 31.19,49.67 C48.2 ; 31.19,49.67 C49.1
  vias: v1(26.46,76.52) v1(26.46,76) v1(28.09,51.68) v1(28.08,51.14) v1(28.59,51.37)
2.8V: length 2.8
  Top Layer w0.254: C47.2 26.1,49.9 ; 26.1,49.9 R25.1 ; 26.1,49.9 26.1,49.37 C46.1
  vias: v1(22.71,78.04) v1(22.73,77.52) v1(24.36,51.5) v1(24.69,51.01) v1(25.04,51.47)
3V3: length 122.4
  Top Layer w0.254: 60.01,42.7 60.01,41.78 arc(59.93,41.41) 59.72,41.1 59.58,40.96 arc(59.42,40.71) C30.1 59.05,40.73 59.05,41.89 58.57,42.37 v1(58.57,42.45) ; C44.1 29.17,39.1 R23.1 27.49,37.94 26.98,38.45 ; 62.75,43.45 62.86,43.45 arc(63.17,43.38) 63.43,43.21 63.97,42.67 arc(64.01,42.61) C26.2 ; R64.2 60.69,50.09 arc(60.69,50.09) R65.2 arc(60.82,50.7) 61.16,51.21 61.46,51.52 arc(61.64,51.64) 61.86,51.68 63.72,51.68 arc(64.23,51.58) 64.66,51.29 ; v1(15.23,106.48) 15.23,101.7 16.24,100.69 R33.2
  Top Layer w0.3: 69.91,62.78 69.54,62.42 69.54,60.1 R32.2 ; 69.91,62.78 v1(70.85,62.78) 70.86,62.77 ; 69.91,62.78 69.91,65.68 R31.2 ; 64.41,51.01 64.41,51.04 64.66,51.29 66.71,51.29 ; 64.41,51.01 64.41,44.5 65.07,43.84 BUZZER1.1 71.58,43.84 v1(72.39,44.65) ; 64.41,51.01 arc(64.34,51.33) 64.16,51.6 ; R1.1 65.6,70.64 v1(65.6,73.93) 65.61,73.94 ; R19.2 26.64,53.88 R22.2 25.41,53.84 25.41,53.29 25.09,52.96 23.85,52.96 23.19,53.62 23.19,54.91 v1(21.99,56.11) ; v1(68.7,71.59) 69.53,71.59 R14.2
  Top Layer w0.5: v1(65.61,74.43) 65.61,73.94
  Inner2 w0.3: v1(48.42,33.36) 47.18,33.36 46.41,34.13 42.12,34.13 40.4,35.85 32.96,35.85 31.98,34.87 28.57,34.87 27.59,33.89 19.44,33.89 18.84,34.48 v1(17.91,34.48)
  Bottom Layer w0.254: v1(64.15,43.32) 59.44,43.32 v1(58.57,42.45)
  Bottom Layer w0.3: 17.54,29.64 17.54,31.18 17.36,31.35 17.99,31.35 18.34,31 18.34,29.64 ; 16.74,29.64 16.74,31.18 16.91,31.35 17.09,31.35 17.22,31.49 17.22,32.99 17.91,33.67 v1(17.91,34.48) ; v1(48.42,33.36) 49.04,32.75 49.04,29.64
  Bottom Layer w0.508: v1(17.91,34.48) 20.51,37.09 21.6,37.09 ; 21.6,37.09 v1(22.62,38.11) 22.62,37.1 v1(22.64,37.09) 21.6,37.09
  vias: v1(15.52,106.92) v1(15.83,106.48) v1(16.16,106.91) v1(22.64,37.6) v1(23.1,37.88) v1(23.11,37.36) v1(42.78,110.65) v1(42.77,110.1) v1(43.34,110.63) v1(43.36,110.1) v1(57.5,83.5) v1(58.18,83.49) v1(58.82,83.49) v1(59.69,110.96) v1(59.69,110.43) v1(60.21,110.96) v1(60.22,110.44) v1(65.5,81.23) v1(65.5,80.58) v1(65.5,79.97)
5V: length 22.9
  Top Layer w0.254: USB2.A4 20.49,54.34 20.31,54.15 18.46,54.15 18.44,54.17 ; 21.09,67.23 20.41,67.23 18.78,65.59 18.78,63.4
  Top Layer w0.508: SW1.3 16.67,38.87 16.12,39.42 16.12,43.11 15.01,44.22 15.01,48.13 18.01,51.14
5V-OUT: length 96.1
  Top Layer w0.254: U19.16 30.75,43.17 31.19,42.74 32.3,42.74 ; R15.1 21.15,41.11 22.27,39.99 v1(22.8,39.99)
  Top Layer w0.3: U9.7 30.79,62.35 30.81,62.34 v1(31.41,62.34) 31.65,62.11 31.65,56.24 31.65,56.25 ; LED4.1 21.03,72.94 v1(21.91,72.05)
  Top Layer w0.508: F1.2 19.59,37.33 17.13,34.87 v1(17.13,34.59)
  Inner2 w0.3: v1(17.13,34.59) 17.83,35.29 31.8,35.29 32.79,36.28 40.66,36.28 42.15,34.8 46.57,34.8 v1(47.37,34)
  Bottom Layer w0.3: 48.24,29.64 48.24,32.55 47.37,33.42 v1(47.37,34) ; v1(32.45,41.3) 33.28,42.12 33.28,54.62 v1(31.65,56.24) ; v1(31.41,62.34) 23.17,62.34 22.46,63.05 22.46,71.5 v1(21.91,72.05) ; 15.94,29.64 15.94,31.27 16.69,32.02 16.69,33.15 17.13,33.58 v1(17.13,34.59)
  vias: v1(22.45,39.63) v1(23.18,40.38) v1(23.54,40.77) v1(31.91,41.8) v1(31.91,41.28) v1(32.42,41.8)
GND: length 112.5
  Top Layer w0.2: v1(62.17,58.33) 61.57,58.93 60.9,58.93 59.71,60.12 U1.16
  Top Layer w0.254: 32.19,111.64 32.19,111.13 arc(32.13,110.83) v1(31.96,110.58) ; 16.34,29.64 16.34,31.03 16.07,31.3 15.67,31.3 14.38,32.58 14.15,32.58 ; 47.34,32.44 47.45,32.33 ; 47.45,32.33 47.5,32.29 47.64,32.15 47.73,32.06 48.39,32.06 ; 47.45,32.33 47.5,32.29 48.16,32.29 48.39,32.06 ; 47.45,32.33 v1(47.34,32.45) ; U19.17 31.09,43.57 31.26,43.4 v1(31.34,43.4) ; 62.75,45.94 62.01,45.94 60.75,44.68 ; 60.75,44.68 61.5,43.93 61.5,41.53 arc(61.54,41.33) 61.66,41.16 61.99,40.83 arc(62,40.83) 62,40.82 arc(62.13,40.63) 62.18,40.4 C25.2 ; 60.75,44.68 59.49,45.94 58.76,45.94 ; 60.75,44.68 60.51,44.43 60.51,41.48 arc(60.45,41.22) 60.3,40.99 arc(60.16,40.78) 60.11,40.53 60.11,40.33 arc(60.04,40) 59.86,39.71 59.55,39.41 arc(59.47,39.35) C30.2 ; v1(25.43,94.07) 25.43,94.05 27.82,94.05 C80.1 ; 47.3,32.48 48.23,32.48 48.64,32.07 48.64,31.81 ; 48.39,32.06 48.64,31.81 ; U1.51 49.04,76.66 C9.1 48.92,77.07 48.92,77.56 v1(48.79,77.7) ; 48.64,31.81 48.64,29.64 ; v1(23.15,80.27) 22.51,79.63 FPC2.28 ; U1.31 59.68,67.62 60.61,68.54 C22.1 ; C17.2 55.54,48.55 U1.143
  Top Layer w0.3: 47.33,32.48 v1(47.34,32.45) ; U1.61 44.04,75.22 C10.1 ; 15.54,29.64 15.54,31.2 v1(14.12,32.61) ; FPC1.23 43.71,114.04 v1(44.77,115.1) ; v1(22.96,88.02) 22.98,88.04 22.98,92.94 23.23,93.19 C79.1 ; v1(48.42,48.67) 49.04,49.28 U1.130 ; C20.2 41.47,93.81 41.48,93.81 42.91,93.81 v1(43.34,93.38) ; v1(14.95,93.09) 17.85,93.09 18.31,92.63 FPC2.2 ; FPC1.27 41.71,113.84 v1(40.45,115.1) ; v1(44.12,52.19) 44.04,52.1 U1.120 44.04,49.1 43.54,48.61 43.54,47.2 44.24,46.5 44.31,46.5 ; 47.5,32.29 47.28,32.5 ; 47.84,29.64 47.84,31.95 47.64,32.15 47.5,32.29 ; U1.38 55.54,75.33 C8.1 ; C19.1 54.85,95.62 53.85,94.61 51.59,94.61 v1(51.21,94.23)
  Bottom Layer w0.254: v1(14.98,80.04) 15.29,79.73 17.41,79.73 ; v1(17.34,65.75) 17.41,65.68 17.41,64.23 ; v1(24.08,80.24) 25.6,80.24 CARD1.12 ; v1(23.67,67.06) 23.67,65.31 24.75,64.23 CARD1.10
  vias: v1(14.09,47.41) v1(14.05,46.5) v1(14.15,48.4) v1(14.32,42.43) v1(14.32,41.38) v1(14.32,40.38) v1(14.36,49.8) v1(14.48,109.44) v1(14.63,108.38) v1(14.65,35.51) v1(14.94,110.59) v1(14.95,91.83) v1(14.95,90.13) v1(14.95,88.6) v1(14.95,86.98) v1(14.95,85.21) v1(14.95,83.27) v1(14.94,82.17) v1(14.95,81.05) v1(15.24,36.21) v1(15.55,109.44) v1(15.64,108.41) v1(15.61,68.45) v1(15.66,35.52) v1(15.75,55.23) v1(15.75,54.04) v1(15.75,52.66) v1(15.75,51.37) v1(16.01,82.32) v1(16.04,81.3) v1(16.06,110.55) v1(16.2,36.21) v1(16.33,65.75) v1(16.51,109.44) v1(16.63,68.45) v1(16.62,35.53) v1(17.08,36.22) v1(17.2,110.51) v1(17.59,109.42) v1(18.3,110.53) v1(18.47,101.49) v1(18.47,100.57) v1(18.56,48.6) v1(18.56,47.73) v1(18.56,46.9) v1(18.58,45.98) v1(18.83,109.42) v1(18.82,68.33) v1(18.83,67.36) v1(19.06,102.23) v1(19.51,110.52) v1(19.76,53.36) v1(20.14,109.44) v1(20.65,99.64) v1(20.77,110.52) v1(21.24,99.64) v1(21.36,109.44) v1(22,110.51) v1(22,60.1) v1(22.02,59) v1(22.04,58.08) v1(22.01,57.1) v1(22.2,48.7) v1(22.22,47.95) v1(22.22,46.15) v1(22.16,45.07) v1(22.33,109.44) v1(22.24,47.09) v1(23.11,102.71) v1(23.08,45.11) v1(23.19,110.54) v1(23.62,81.08) v1(23.63,69.57) v1(23.64,68.71) v1(23.65,67.87) v1(24.34,110.54) v1(24.62,81.11) v1(25.24,101.29) v1(25.25,100.05) v1(25.25,98.93) v1(25.47,110.55) v1(25.54,68.79) v1(25.54,67.78) v1(26.11,109.92) v1(26.11,108.85) v1(26.05,107.97) v1(26.22,100.07) v1(26.26,101.3) v1(26.24,98.93) v1(26.42,47.07) v1(26.69,110.53) v1(26.83,46.68) v1(26.94,92.64) v1(27.29,109.5) v1(27.29,108.37) v1(27.29,107.39) v1(27.29,106.43) v1(27.29,105.5) v1(27.3,101.3) v1(27.29,100.05) v1(27.27,98.96) v1(27.32,61.15) v1(27.32,60.51) v1(27.28,46.29) v1(28.46,91.31) v1(28.58,41.61) v1(28.76,37.1) v1(29.01,41.18) v1(29.4,37.1) v1(29.94,59.85) v1(29.95,59.13) v1(30.13,55.5) v1(30.13,54.66) v1(30.12,46.07) v1(30.2,108.22) v1(30.2,107.36) v1(30.2,106.46) v1(30.3,41.65) v1(30.46,46.51) v1(30.55,110.58) v1(30.69,46.96) v1(30.84,41.14) v1(31.26,109.69) v1(31.39,97.8) v1(31.39,96.83) v1(31.45,108.71) v1(31.45,107.64) v1(31.45,106.61) v1(32.09,93.99) v1(32.22,96.25) v1(32.54,108.69) v1(32.74,109.69) v1(33.33,110.58) v1(33.4,41.22) v1(33.64,108.58) v1(33.73,96.25) v1(33.71,93.85) v1(33.88,41.61) v1(34.02,109.69) v1(34.03,68.11) v1(34.03,67.1) v1(34.01,50.93) v1(34.49,48.67) v1(34.55,110.57) v1(34.82,108.69) v1(34.91,96.27) v1(34.89,51.29) v1(34.86,50.41) v1(34.89,49.42) v1(35.13,101.93) v1(35.23,109.68) v1(35.2,93.6) v1(35.79,110.57) v1(35.83,92.46) v1(35.83,91.23) v1(35.82,89.77) v1(35.96,108.76) v1(36.14,101.93) v1(36.14,96.27) v1(36.38,109.72) v1(36.51,106.27) v1(36.53,90.53) v1(36.55,107.44) v1(36.55,105.27) v1(36.55,104.19) v1(36.62,93.11) v1(36.6,91.92) v1(36.8,110.57) v1(37.18,101.93) v1(37.17,100.71) v1(37.17,99.83) v1(37.17,98.79) v1(37.17,97.74) v1(37.17,96.55) v1(41.65,115.1) v1(43.19,115.1) v1(45.78,32.45) v1(46.21,115.1) v1(46.2,33.15) v1(46.51,32.46) v1(46.54,38.35) v1(46.57,37.42) v1(46.55,36.31) v1(47.09,37.96) v1(47.13,36.88) v1(47.13,35.65) v1(47.65,37.41) v1(47.76,36.31) v1(47.75,35.08) v1(53.78,41.25) v1(53.82,40.17) v1(53.82,38.99) v1(53.86,37.91) v1(54.75,43.03) v1(54.78,41.95) v1(57.66,47.5) v1(58.16,48.08) v1(58.55,47.52) v1(60.71,66.6) v1(60.71,65.78) v1(61.28,62.96) v1(61.43,66.94) v1(61.43,66.22) v1(62.23,66.93) v1(62.16,57.61) v1(62.32,69.03) v1(62.24,61.13) v1(62.25,60.6) v1(62.34,68.52) v1(62.45,55.58) v1(62.46,55.08) v1(62.8,41.29) v1(63.29,40.33) v1(63.69,48.74) v1(63.71,47.98) v1(63.96,60.33) v1(64.03,40.38) v1(64.63,60.33) v1(64.97,45.53) v1(64.97,44.83) v1(65.3,60.33) v1(65.92,67.46) v1(66.72,67.46) v1(67,54.58) v1(67.07,57) v1(67.39,67.46) v1(67.71,66.7) v1(67.71,65.82) v1(67.71,64.95) v1(67.71,64.18) v1(67.71,63.3) v1(67.71,62.44) v1(67.71,61.64) v1(67.71,60.98) v1(67.71,60.33) v1(70.81,63.51) v1(70.82,55.32) v1(70.82,54.79) v1(72.07,37.31) v1(72.08,36.64) v1(72.91,56.96) v1(72.91,53.49) v1(72.91,52.85) v1(72.94,63.32)
VCC3.3M: length 156.2
  Top Layer w0.2: U1.17 59.89,60.62 60.8,59.71 61.14,59.71
  Top Layer w0.254: C8.2 54.32,75.62 v1(55.33,76.64) ; v1(48.81,78.51) 48.8,78.5 48.24,78.5 47.68,77.95 C9.2
  Top Layer w0.3: C15.1 v1(44.31,48.22) 44.54,48.44 44.54,50.57 ; U1.84 34.11,64.62 C12.1 ; C11.2 37.74,75.43 38.54,74.64 U1.72 ; U2.3 27.4,80.31 27.84,80.75 31.05,80.75 31.62,80.17 v1(31.62,78.64) ; C17.1 56.91,48.53 56.04,49.41 U1.144 56.04,54.73 ; v1(37.94,81.19) 38,81.19 39.03,80.16 42.02,80.16 43.15,79.03 C10.2 43.54,75.04 U1.62 ; 50.51,55.04 50.03,54.56 50.03,52.09 49.54,51.6 U1.131 49.54,47.72 C16.1 ; 50.51,55.04 50.96,55.49 ; 50.51,55.04 50.51,55.49 ; U1.52 48.54,75.03 47.68,75.88 C9.2 ; C19.2 55.19,93.81 53.06,93.81 ; 55.72,55.12 54.69,55.12 53.95,55.86 51.33,55.86 50.96,55.49 ; 55.72,55.12 56.43,55.12 ; 55.72,55.12 56.04,54.8 56.04,54.73 ; U1.108 33.96,52.62 C14.1 ; 39.91,94.9 40.19,94.61 41.48,94.61 ; 50.96,55.49 50.51,55.49 ; C1.2 60.34,55.12 U1.6 56.43,55.12 ; 56.04,54.73 56.43,55.12 ; 50.51,55.49 50.04,55.96 50.04,58.47 51.58,60.01 53.06,60.01 53.43,59.64 55.14,59.64 56.12,60.62 U1.17 ; C8.2 54.32,74.55 55.04,73.83 U1.39 ; C13.1 34.23,59.12 U1.95
  Bottom Layer w0.254: R11.1 31.71,70.04 31.35,70.4 31.01,70.4 30.72,70.7 v1(29.85,70.7) ; v1(29.33,70.7) 28.25,70.7 CARD1.4 ; 31.68,73.17 31.73,73.12 v1(32.4,73.12) 32.4,73.56 v1(32.38,73.58) ; 31.68,73.17 31.68,74.21 R4.1 ; 31.68,73.17 31.68,73.04 31.69,73.02 ; 31.78,66.5 31.76,66.53 31.76,67.43 31.71,67.48 ; 31.78,66.5 R13.1 ; 31.78,66.5 v1(31.78,65.7) ; v1(31.7,71.31) 31.7,71.85 31.69,71.86
  Bottom Layer w0.3: v1(55.33,76.64) 55.33,79.51 55.85,80.03 v1(55.85,90.47) 55.19,91.14 v1(55.19,93.9) ; v1(48.26,47.56) 44.97,47.56 v1(44.31,48.22) 38.8,48.22 v1(37,46.42) ; v1(36.96,75.53) 36.96,77.49 37.94,78.47 v1(37.94,81.19) 37.94,91.18 39.82,93.05 v1(39.82,95.46)
  Bottom Layer w0.5: v1(37,46.42) v1(37,45.91)
  Bottom Layer w0.508: v1(29.85,70.7) v1(29.33,70.7)
  vias: v1(23.58,38.95) v1(23.88,39.47) v1(24.14,38.93) v1(24.46,39.47) v1(24.74,38.93) v1(33.92,52.16) v1(34.09,65.21) v1(34.18,59.61) v1(39.86,95.54)
VDD-SDIO: length 12
  Top Layer w0.203: v2(23.34,95.96) 23.34,96.09 24.29,97.04 U22.26
  Bottom Layer w0.3: v2(25.76,87.45) 24.98,87.45 23.34,89.09 v2(23.34,95.96)
VDDA: length 14.1
  Top Layer w0.254: U1.30 59.76,67.12 60.38,67.74 63.49,67.74 64.09,68.35 R1.2
  Top Layer w0.3: 59.89,68.62 61.22,69.95 C22.2 ; 59.89,68.62 U1.33 ; 59.89,68.62 59.39,68.12 U1.32
ADC-LIGHT: length 57.3
  Top Layer w0.152: 59.04,29.64 59.04,31.21 58.36,31.88 58.36,38.88 58.49,39.01 58.49,41.55 v1(58.5,41.56) ; R63.1 67.88,51.92 68.33,52.37 v1(71.13,52.37) ; v1(59.44,61.62) 59.43,61.62 U1.19
  Bottom Layer w0.152: v1(59.44,61.62) 60.24,61.62 60.75,61.12 60.75,60.04 61.79,59 68.01,59 71.35,55.66 71.35,52.58 v1(71.13,52.37) 71.13,49.44 70.34,48.65 70.34,44.55 68.56,42.78 59.85,42.78 58.64,41.56 v1(58.5,41.56)
BEEP: length 57.8
  Top Layer w0.152: v1(70.79,48.4) 67.74,48.4 67.22,47.88 ; 58.24,29.64 58.24,31.25 58.01,31.47 v1(58.01,40.97) ; U1.20 59.82,62.12
  Bottom Layer w0.152: 58.01,40.96 58.72,40.96 60.25,42.5 68.71,42.5 70.79,44.58 v1(70.79,48.4) 71.63,49.23 71.63,55.77 68.13,59.27 61.9,59.27 61.03,60.15 61.03,61.23 60.14,62.12 v1(59.82,62.12)
BOOT0: length 107.1
  Top Layer w0.152: v1(33.57,82.7) 34.18,83.32 34.18,83.81 ; v1(53.72,53.67) 53.04,52.98 U1.138 ; v1(63.76,81.24) 63.08,81.92 H2.10
  Inner2 w0.152: v1(53.72,53.67) 53.1,53.05 25.03,53.05 24,54.07 v1(23.96,54.07)
  Bottom Layer w0.152: v1(63.76,81.24) 63.76,72.46 56.65,65.35 56.65,56.86 53.77,53.98 53.77,53.72 v1(53.72,53.67)
  Bottom Layer w0.254: v1(33.57,82.7) 34.64,82.7 35.22,82.13 35.22,59.92 32.89,57.59 27.48,57.59 v1(23.96,54.07)
BOOT1: length 122.2
  Top Layer w0.152: 50.51,72.23 50.51,82.42 47.28,85.65 47.28,101.75 46.51,102.52 v1(46.49,102.52) ; 53.55,64.46 53.78,64.48 54.16,64.87 54.16,65.87 55.62,67.33 55.62,69.8 56.51,70.68 56.51,74.95 57.37,75.81 59.07,75.81 59.58,76.33 59.58,80.9 58.57,81.92 H2.9 ; 53.55,64.46 51.87,64.46 50.54,65.79 U1.48 ; 53.55,64.46 53.62,64.46 ; v1(41.07,108.06) 41.07,110.81 40.71,111.18 FPC1.29 ; 34.74,29.64 34.74,31.21 37.21,33.69 37.21,37.32 37.25,37.28
  Top Layer w0.254: R16.2 55.82,81.92 H2.9
  Inner1 w0.152: v1(37.25,37.24) 37.25,37.3 37.21,37.33 37.21,37.65 43.51,43.94 43.51,55.16 52.81,64.47 53.54,64.47 v1(53.55,64.48)
  Bottom Layer w0.152: v1(41.07,108.06) 41.07,107.94 v1(46.49,102.52)
CLK: length 65.4
  Top Layer w0.152: v1(37.15,43.42) 37.52,43.79 37.52,47.43 39.54,49.45 U1.111
  Inner1 w0.152: v1(21.94,36.36) 21.94,36.34 21.99,36.29 ; 22.13,36.43 29.91,36.43 35.4,41.93 35.65,41.93 v1(37.15,43.42) 37.15,43.84 32.35,48.64 32.35,68.37 32.19,68.53 v1(31.49,68.53)
  Bottom Layer w0.152: v1(21.94,36.36) 21.94,36.36 21.94,31.64 21.59,31.28 21.59,29.69 21.54,29.64 ; R11.2 30.85,68.81 31.13,68.53 v1(31.49,68.53)
  Bottom Layer w0.254: R11.2 30.66,69.83 CARD1.5
CMD: length 59.6
  Top Layer w0.152: v1(42.96,60.07) 42.38,59.49 42.38,52.88 42.04,52.54 U1.116 42.04,44.77 51.48,35.32 51.48,32.57 v1(51.48,32.57)
  Inner2 w0.152: v1(34.57,61.55) 41.04,61.55 41.42,61.17 41.42,60.72 42.06,60.07 v1(42.96,60.07)
  Bottom Layer w0.152: R8.2 30.83,71.16 31.13,70.86 32.54,70.86 34.55,68.85 34.55,61.57 v1(34.57,61.55) ; v1(51.48,32.57) 51.48,29.69 51.44,29.64
  Bottom Layer w0.254: CARD1.3 30.66,72.03 R8.2
D0: length 56.9
  Top Layer w0.152: 37.93,57.62 37.93,57.62 36.48,57.62 U1.98
  Inner1 w0.152: v1(33.51,68.55) 33.51,66.79 33.95,66.35 33.95,66.02 33.64,65.71 33.64,58.22 33.96,57.9 v1(34.77,57.9)
  Bottom Layer w0.152: 26.34,29.64 26.34,30.72 26.74,31.12 27.08,31.12 35.97,40.01 35.97,47.18 38.91,50.13 38.91,57.28 38.58,57.61 v1(37.88,57.61) 35.05,57.61 v1(34.77,57.9) ; v1(33.51,68.55) 32.59,68.55 32.05,68 31.38,68 30.88,67.51 R12.2
  Bottom Layer w0.254: R12.2 30.7,67.63 CARD1.7
D1: length 57.4
  Top Layer w0.152: v1(38.28,57.07) 38.24,57.11 36.47,57.11 U1.99
  Inner1 w0.152: v1(33.37,66.21) 33.21,66.05 33.21,57.7 33.54,57.37 v1(34.21,57.37)
  Bottom Layer w0.152: 25.54,29.64 25.54,30.7 26.3,31.47 27.03,31.47 35.69,40.13 35.69,47.33 38.57,50.21 38.57,56.78 v1(38.28,57.07) 35.87,57.07 35.66,57.28 34.31,57.28 v1(34.21,57.37)
  Bottom Layer w0.254: CARD1.8 30.62,66.53 30.89,66.26 30.89,65.07 31.43,64.54 32.86,64.54 33.37,65.05 v1(33.37,66.21)
D2: length 78
  Top Layer w0.152: v1(37.15,41.79) 38.08,42.72 38.08,47.1 40.54,49.56 U1.113
  Inner1 w0.152: 32.64,75.36 v1(32.9,75.36) 32.91,75.35 32.91,48.91 37.91,43.9 37.91,42.56 v1(37.15,41.79) 36.14,40.79 35.05,40.79 30.14,35.88 24.57,35.88 24.09,35.39 20.23,35.39 19.67,34.83 v1(19.67,34.66)
  Bottom Layer w0.152: 19.94,29.64 20.03,29.73 20.03,34.3 v1(19.67,34.66)
  Bottom Layer w0.254: v1(32.9,75.36) 31.08,75.36 30.81,75.09 30.81,74.23 R4.2 30.8,74.23 CARD1.1
D3: length 71.5
  Top Layer w0.152: v1(37.15,42.54) 37.8,43.19 37.8,47.32 40.04,49.56 U1.112
  Inner1 w0.152: v1(32.43,72.42) 32.44,72.42 32.63,72.23 32.63,48.75 37.6,43.79 37.6,42.99 v1(37.15,42.54) 36.14,41.54 35.4,41.54 30.02,36.15 24.33,36.15 24.03,35.86 v1(20.91,35.86)
  Bottom Layer w0.152: R7.2 30.81,72.89 31.29,72.42 v1(32.43,72.42) ; 20.74,29.64 20.91,29.82 v1(20.91,35.86)
  Bottom Layer w0.254: CARD1.2 30.72,73.13 R7.2
D+: length 6.2
  Top Layer w0.152: v1(20.25,65.1) 20.25,65.1 21.15,65.1 21.22,65.02 22.73,65.02 23.06,65.35 U9.1 ; v1(20.24,64.09) 21.14,64.09 21.15,64.1
  Bottom Layer w0.152: v1(20.24,64.09) 19.99,64.09 19.75,64.33 19.75,64.83 20.02,65.1 v1(20.25,65.1)
D-: length 6.1
  Top Layer w0.152: U9.2 23.09,64.36 22.77,64.67 21.22,64.67 21.13,64.59 20.02,64.59 19.75,64.85 19.75,65.27 20.08,65.6 21.15,65.6
DTR: length 4.7
  Top Layer w0.152: R21.2 23.56,58.88 22.61,59.82 22.61,61.88 23.09,62.35 U9.4
ESP3V3: length 6.8
  Top Layer w0.152: v1(30.91,98.45) 30.91,98.55 29.56,99.89 28.72,99.89
  Top Layer w0.203: v2(32.09,102.28) 31.58,102.28 30.24,100.95 28.72,100.95
  vias: v1(19.05,93.68) v1(19.55,93.68) v1(22.57,100.39) v1(23.51,107) v1(23.89,106.55) v1(24.21,106.99) v1(24.56,106.55) v1(24.9,107) v1(28.36,96.41) v2(30.81,103.67)
ESP-RST: length 47.4
  Top Layer w0.152: U22.9 25.69,103.26 24.22,104.73 18.71,104.73 18.31,105.14 16.57,105.14 v1(16.15,104.73) ; D1.1 25.11,82.78 v1(24.58,82.78)
  Top Layer w0.3: v1(15.34,97.15) 16.23,98.05 SW5.1 17.28,99.52 R33.1
  Bottom Layer w0.152: v1(24.58,82.78) 16.94,82.78 15.49,84.23 15.49,97 v1(15.34,97.15) 15.49,97.3 15.49,102.02 15.27,102.24 15.27,103.85 v1(16.15,104.73)
ESP-U0RXD: length 49.9
  Top Layer w0.152: H1.7 57.76,103.07 57.1,103.72 57.1,104.77 55.78,106.09 v1(55.78,107.54) ; v1(30.21,94.78) 29.66,95.33 29.66,98.35 29.16,98.85 28.72,98.85
  Bottom Layer w0.152: v1(30.21,94.78) 36.84,94.78 38.07,96.01 38.07,108.12 39.06,109.11 54.21,109.11 v1(55.78,107.54)
ESP-U0TXD: length 48.1
  Top Layer w0.152: v1(30.24,95.48) 29.93,95.79 29.93,98.57 29.31,99.2 28.72,99.2 ; H1.5 58.13,105.54 56.91,105.54 56.25,106.2 56.25,107.91 v1(55.81,108.35)
  Bottom Layer w0.152: v1(30.24,95.48) 37.01,95.48 37.69,96.16 37.69,108.22 38.86,109.38 54.78,109.38 v1(55.81,108.35)
ESP-U1RXD: length 86.1
  Top Layer w0.152: v3(23.25,96.91) 23.58,96.91 23.94,97.27 U22.25 ; v1(41.66,68.86) 40.04,70.49 U1.69 40.04,78.2 36.58,81.65 36.58,85.47 35.92,86.13 v1(35.21,86.13)
  Inner1 w0.152: v1(35.21,86.13) 34.89,86.45 25.29,86.45 22.77,88.97 22.77,96.44 v3(23.25,96.91) ; v1(41.66,68.86) 41.66,68.65 40.19,67.19 40.19,44.58 v1(39.42,43.81)
  Bottom Layer w0.152: 37.54,29.64 37.54,31.03 41.77,35.26 41.77,39.4 39.41,41.76 39.41,43.79 v1(39.42,43.81)
ESP-U1TXD: length 84.6
  Top Layer w0.152: v3(24.08,95.4) 24.08,96.36 24.64,96.92 U22.27 ; v1(40.92,68.83) 39.54,70.22 U1.70 39.54,78.12 36.22,81.44 36.22,85.19 v1(35.9,85.5)
  Inner1 w0.152: v1(35.9,85.5) 35.9,86.26 35.35,86.81 25.48,86.81 24.08,88.22 v3(24.08,95.4) ; v1(38.92,43.34) 38.92,43.95 39.91,44.94 39.91,67.31 40.92,68.32 v1(40.92,68.83)
  Bottom Layer w0.152: 36.74,29.64 36.74,30.95 41.32,35.54 41.32,39.25 38.91,41.66 38.91,43.33 v1(38.92,43.34)
F-CS: length 61.8
  Top Layer w0.152: U2.1 29.94,78.23 31.32,76.86 33.95,76.86 v1(36.92,73.89) ; v1(38.78,70.13) 38.77,70.12 U1.73
  Inner1 w0.127: v1(38.78,70.13) 37.87,70.13 36.92,71.08 v1(36.92,73.89)
  Inner1 w0.152: v1(39.37,45.19) 39.64,45.46 39.64,69.68 39.19,70.13 v1(38.78,70.13)
  Bottom Layer w0.152: v1(39.37,45.19) 38.45,44.28 38.45,41.47 40.98,38.94 40.98,35.92 35.94,30.87 35.94,29.64
FSMC-A0: length 74.3
  Top Layer w0.152: 59.98,57.13 59.99,57.12 U1.10 ; 64.64,29.64 64.64,29.65 v1(64.64,32.03) ; 58.08,57.11 50.61,57.11 v1(50.57,57.15) ; U3.5 53.06,89.02 v1(51.87,89.02)
  Inner1 w0.152: v1(59.96,57.13) 60,50.31 60.72,49.6 60.72,39.54 62.96,37.29 62.98,35.15 64.64,33.5 v1(64.64,32.03)
  Bottom Layer w0.152: v1(51.87,89.02) 50.93,88.08 50.93,82.73 51.59,82.07 51.59,72.15 50.6,71.16 50.6,60.34 49.56,59.3 49.56,57.44 49.85,57.15 v1(50.57,57.15)
FSMC-A1: length 72.3
  Top Layer w0.152: v1(51.89,88.23) 51.91,88.21 U3.4 ; v1(63.28,33.24) 63.39,33.24 63.84,32.8 63.84,29.64 ; v1(59.49,57.64) 59.47,57.62 U1.11 51.28,57.62
  Top Layer w0.254: 51.28,57.62 v1(51.28,57.62)
  Inner1 w0.152: v1(59.49,57.64) 59.51,57.61 59.51,50.26 60.44,49.33 60.44,39.35 62.64,37.14 62.64,34.86 63.31,34.19 63.31,33.27 v1(63.28,33.24)
  Bottom Layer w0.152: v1(51.89,88.23) 51.36,87.69 51.36,83.12 51.98,82.5 51.98,71.76 50.88,70.66 50.88,60.07 50.03,59.21 50.03,57.94 50.36,57.6 51.26,57.6 v1(51.28,57.62)
FSMC-A2: length 71.8
  Top Layer w0.152: 63.04,29.64 63.04,32.58 62.33,33.28 v1(62.33,34.38) ; U3.3 53.04,87.43 v1(51.87,87.43) ; 60.03,58.12 60.03,58.11 50.63,58.11
  Inner1 w0.152: v1(59.95,58.12) 59.33,58.12 59.03,57.82 59.03,50.25 60.16,49.12 60.16,39.08 62.33,36.9 v1(62.33,34.38)
  Bottom Layer w0.152: v1(51.87,87.43) 51.8,87.36 51.8,83.46 52.34,82.92 52.34,71.2 51.16,70.02 51.16,59.92 50.62,59.38 v1(50.62,58.11)
FSMC-A3: length 69.2
  Top Layer w0.152: v1(59.49,58.62) 59.5,58.62 U1.13 51.17,58.62 v1(51.15,58.6) ; v1(61.29,34.34) 61.29,32.92 62.24,31.97 62.24,29.64 ; v1(52.27,85.11) 51.9,85.48 51.9,86.29 52.22,86.61 U3.2
  Inner1 w0.152: v1(61.29,34.34) 61.29,36.98 59.88,38.39 59.88,48.97 58.75,50.09 58.75,58.04 59.34,58.62 v1(59.49,58.62)
  Bottom Layer w0.152: v1(52.27,85.11) 52.27,83.87 52.73,83.42 52.73,70.63 51.44,69.34 51.44,59.6 51.15,59.31 v1(51.15,58.6)
FSMC-A4: length 68
  Top Layer w0.152: v1(52.83,84.72) 52.83,85.81 U3.1 ; 51.73,59.15 51.74,59.14 ; 51.73,59.15 51.84,59.15 52.02,58.96 56.54,58.96 56.7,59.12 U1.14 60.01,59.12 60,59.11 ; 51.73,59.15 51.67,59.09 51.68,59.08 v1(51.73,59.08) ; 61.44,29.64 61.44,31.64 60.29,32.79 v1(60.29,34.33)
  Inner1 w0.152: v1(60.29,34.33) 60.29,37.59 59.6,38.27 59.6,48.79 58.48,49.91 58.48,58.25 59.34,59.11 59.92,59.11 v1(59.93,59.11)
  Bottom Layer w0.152: v1(51.73,59.08) 51.72,59.09 51.72,69.23 53.13,70.64 53.13,83.71 52.79,84.05 52.79,84.72 v1(52.83,84.72)
FSMC-A5: length 92.7
  Top Layer w0.152: 59.51,59.62 U1.15 56.64,59.62 56.26,59.24 52.89,59.24 v1(52.68,59.45) ; 59.51,59.62 59.65,59.62 ; 59.51,59.62 59.51,59.62 ; v1(46.46,101.53) 45.17,101.53 44.88,101.83 41.49,101.83 U3.24 ; v1(59.28,34.31) 59.28,33.1 60.64,31.75 60.64,29.64
  Inner1 w0.152: v1(59.28,34.31) 59.28,48.6 58.2,49.68 58.2,58.48 59.34,59.62 v1(59.5,59.62)
  Bottom Layer w0.152: v1(46.46,101.53) 46.46,101.55 46.87,101.13 51.81,101.13 53.97,98.97 53.97,70.42 52.58,69.03 52.58,59.55 v1(52.68,59.45)
FSMC-A6: length 79
  Top Layer w0.152: 51.84,29.64 51.84,31.87 v1(51.96,31.99) ; U3.25 45.47,101.01 46.36,100.12 46.36,83.82 49.54,80.64 U1.50 49.54,70.22 49.95,69.81 49.95,61.92 48.8,60.77 48.8,53.19 49.31,52.68 v1(49.31,52.32)
  Inner1 w0.152: v1(51.96,31.99) 51.96,49.25 49.31,51.9 v1(49.31,52.32)
FSMC-A7: length 77.5
  Top Layer w0.152: v1(48.63,52.39) 48.37,52.65 48.37,61.1 49.6,62.33 49.6,69.57 48.86,70.32 48.86,70.34 48.04,71.17 U1.53 ; 51.04,29.64 51.04,31.97 v1(50.99,32.02) ; 48.01,72.23 48.01,74.9 45.95,76.96 45.95,99.26 45,100.21 U3.26
  Inner1 w0.152: v1(50.99,32.02) 50.99,49.52 48.63,51.88 v1(48.63,52.39)
FSMC-A8: length 76.2
  Top Layer w0.152: v1(48.09,52.01) 48.09,52.07 48.09,61.21 49.33,62.44 49.33,69.46 48.09,70.7 47.74,70.7 47.54,70.9 U1.54 ; 47.51,72.23 47.51,74.91 45.49,76.93 45.49,98.21 44.29,99.41 41.48,99.41 ; v1(49.98,32.03) 50.24,31.78 50.24,29.64
  Inner1 w0.152: v1(48.09,52) 48.09,51.6 49.98,49.71 v1(49.98,32.03)
FSMC-A9: length 64
  Top Layer w0.152: U3.42 43.99,87.41 45.06,86.35 45.06,76.9 47.01,74.94 47.01,72.23 ; v1(47.6,52.39) 47.6,61.11 48.96,62.47 48.96,69.43 47.97,70.42 47.35,70.42 47.04,70.72 U1.55 ; v1(49,34.55) 49,32.05 49.44,31.62 49.44,29.64
  Inner1 w0.152: v1(49,34.55) 49,49.38 47.6,50.78 v1(47.6,52.39)
FSMC-A10: length 60.3
  Top Layer w0.152: v1(42.65,107.27) 42.18,106.81 40.63,106.81 37.85,104.02 37.85,88.69 39.93,86.61 U3.43 43.89,86.61 44.58,85.93 44.58,76.9 46.51,74.97 46.51,72.23 ; FPC1.2 54.21,108.51 v1(54.04,108.35)
  Bottom Layer w0.152: v1(42.65,107.27) 43.72,108.35 v1(54.04,108.35)
FSMC-A11: length 16.6
  Top Layer w0.152: 46.01,72.23 46.01,74.99 44.11,76.89 44.11,85.08 43.38,85.81 U3.44
FSMC-A12: length 51.4
  Top Layer w0.152: v1(42.6,63.12) 42.6,63.12 U1.87 ; U3.22 51.12,102.61 49.2,100.69 v1(49.2,99.16)
  Bottom Layer w0.152: v1(49.2,99.16) 45.04,95 45.04,64.99 43.18,63.12 v1(42.6,63.12)
FSMC-A13: length 51
  Top Layer w0.152: v1(49.73,98.58) 49.73,100.28 51.26,101.81 U3.21 ; v1(42.05,62.62) U1.88
  Bottom Layer w0.152: v1(49.73,98.58) 49.73,98.05 45.44,93.77 45.44,64.99 43.07,62.62 v1(42.05,62.62)
FSMC-A14: length 50.6
  Top Layer w0.152: v1(42.55,62.11) 42.54,62.12 U1.89 ; U3.20 51.41,101.01 50.3,99.9 v1(50.3,99.16)
  Bottom Layer w0.152: v1(50.3,99.16) 50.3,98.01 45.82,93.52 45.82,64.84 43.09,62.11 v1(42.55,62.11)
FSMC-A15: length 50.3
  Top Layer w0.152: U3.19 51.28,100.21 50.84,99.78 v1(50.84,98.6) ; v1(42.07,61.62) U1.90
  Bottom Layer w0.152: v1(50.84,98.6) 50.84,98 46.2,93.35 46.2,64.83 42.99,61.62 v1(42.07,61.62)
FSMC-A16: length 106.2
  Top Layer w0.152: U1.80 36.49,66.61 41.93,66.61 42.21,66.33 v1(42.9,66.33) ; 53.06,99.41 51.85,99.41 v1(51.55,99.71)
  Inner1 w0.152: v1(55.44,37.83) 55.56,37.83 56.15,38.42 56.15,54.77 54.99,55.94 54.99,69.28 54.39,69.88 52.64,69.88 52,69.24 52,67.47 48.9,64.37 44.85,64.37 v1(42.9,66.33)
  Bottom Layer w0.152: v1(42.9,66.33) 44.66,68.09 44.66,95.26 49.11,99.71 51.55,99.71 v1(51.55,99.71) ; 61.84,29.64 61.84,31.11 58.76,34.19 58.76,34.51 v1(55.44,37.83)
